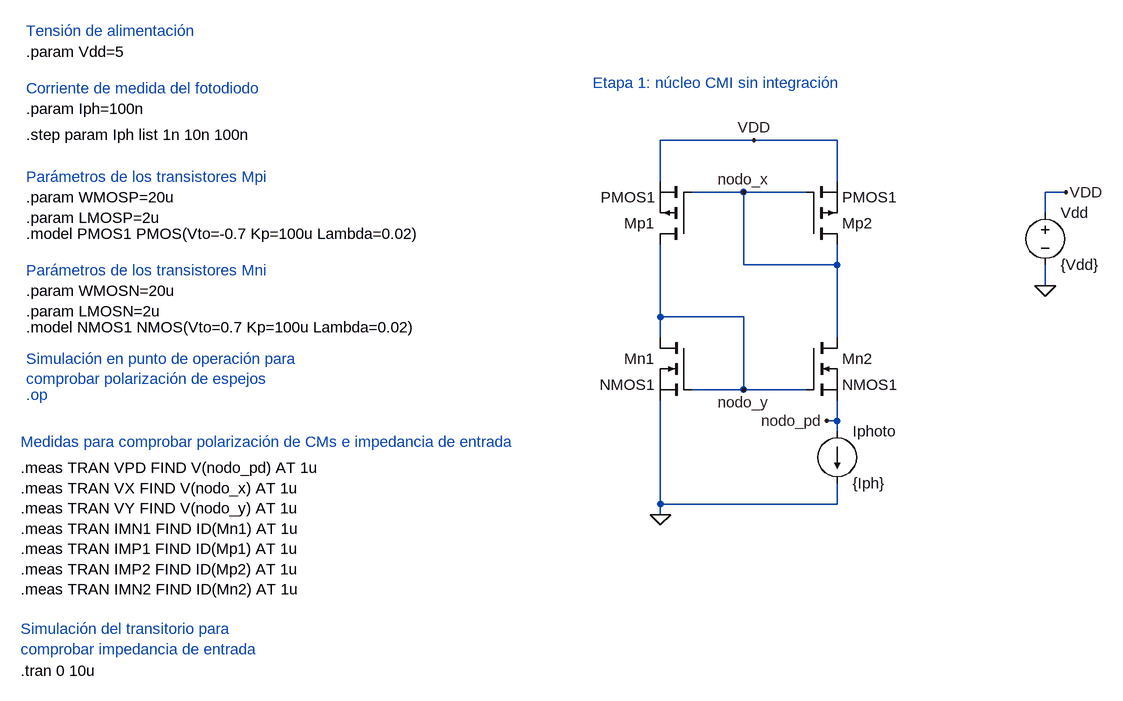
[diagram p0: schematic CMI_Etapa1.asc]
CMI_Etapa1.asc, the LTspice schematic file:
Version 4.1
SHEET 1 880 680
WIRE 144 -496 0 -496
WIRE 272 -496 144 -496
WIRE 0 -432 0 -496
WIRE 272 -432 272 -496
WIRE 128 -416 48 -416
WIRE 224 -416 128 -416
WIRE 624 -416 592 -416
WIRE 592 -384 592 -416
WIRE 128 -304 128 -416
WIRE 272 -304 272 -336
WIRE 272 -304 128 -304
WIRE 592 -272 592 -304
WIRE 0 -224 0 -336
WIRE 128 -224 0 -224
WIRE 0 -192 0 -224
WIRE 272 -192 272 -304
WIRE 128 -112 128 -224
WIRE 128 -112 48 -112
WIRE 224 -112 128 -112
WIRE 272 -64 272 -96
WIRE 272 -64 256 -64
WIRE 272 -48 272 -64
WIRE 0 64 0 -96
WIRE 272 64 272 32
WIRE 272 64 0 64
WIRE 0 80 0 64
FLAG 144 -496 VDD
FLAG 0 80 0
FLAG 256 -64 nodo_pd
FLAG 128 -416 nodo_x
FLAG 128 -112 nodo_y
FLAG 592 -272 0
FLAG 624 -416 VDD
SYMBOL current 272 -48 R0
SYMATTR InstName Iphoto
SYMATTR Value {Iph}
SYMBOL nmos 48 -192 M0
SYMATTR InstName Mn1
SYMATTR Value NMOS1
SYMATTR SpiceLine L={LMOSN} W={WMOSN}
SYMBOL nmos 224 -192 R0
SYMATTR InstName Mn2
SYMATTR Value NMOS1
SYMATTR SpiceLine L={LMOSN} W={WMOSN}
SYMBOL pmos 48 -336 R180
SYMATTR InstName Mp1
SYMATTR Value PMOS1
SYMATTR SpiceLine L={LMOSP} W={WMOSP}
SYMBOL pmos 224 -336 M180
SYMATTR InstName Mp2
SYMATTR Value PMOS1
SYMATTR SpiceLine L={LMOSP} W={WMOSP}
SYMBOL voltage 592 -400 R0
SYMATTR InstName Vdd
SYMATTR Value {Vdd}
TEXT -104 -584 Left 2 ;Etapa 1: núcleo CMI sin integración
TEXT -976 -576 Left 2 ;Corriente de medida del fotodiodo
TEXT -976 -544 Left 2 !.param Iph=100n
TEXT -976 -504 Left 2 !.step param Iph list 1n 10n 100n
TEXT -976 -408 Left 2 !.param WMOSP=20u\n.param LMOSP=2u
TEXT -976 -440 Left 2 ;Parámetros de los transistores Mpi
TEXT -976 -352 Left 2 !.model PMOS1 PMOS(Vto=-0.7 Kp=100u Lambda=0.02)
TEXT -976 -264 Left 2 !.param WMOSN=20u\n.param LMOSN=2u
TEXT -976 -296 Left 2 ;Parámetros de los transistores Mni
TEXT -976 -208 Left 2 !.model NMOS1 NMOS(Vto=0.7 Kp=100u Lambda=0.02)
TEXT -976 -664 Left 2 ;Tensión de alimentación
TEXT -976 -632 Left 2 !.param Vdd=5
TEXT -976 -104 Left 2 ;.op
TEXT -984 320 Left 2 !.tran 0 10u
TEXT -976 -160 Left 2 ;Simulación en punto de operación para \ncomprobar polarización de espejos
TEXT -984 256 Left 2 ;Simulación del transitorio para \ncomprobar impedancia de entrada
TEXT -984 8 Left 2 !.meas TRAN VPD FIND V(nodo_pd) AT 1u\n.meas TRAN VX FIND V(nodo_x) AT 1u\n.meas TRAN VY FIND V(nodo_y) AT 1u\n.meas TRAN IMN1 FIND ID(Mn1) AT 1u\n.meas TRAN IMP1 FIND ID(Mp1) AT 1u\n.meas TRAN IMP2 FIND ID(Mp2) AT 1u\n.meas TRAN IMN2 FIND ID(Mn2) AT 1u
TEXT -984 -32 Left 2 ;Medidas para comprobar polarización de CMs e impedancia de entrada

The netlist it stands for:
* CMI_Etapa1.asc
Iphoto nodo_pd 0 {Iph}
Mn1 nodo_y nodo_y 0 0 NMOS1 L={LMOSN} W={WMOSN}
Mn2 nodo_x nodo_y nodo_pd nodo_pd NMOS1 L={LMOSN} W={WMOSN}
Mp1 nodo_y nodo_x VDD VDD PMOS1 L={LMOSP} W={WMOSP}
Mp2 nodo_x nodo_x VDD VDD PMOS1 L={LMOSP} W={WMOSP}
Vdd VDD 0 {Vdd}
.model NMOS NMOS
.model PMOS PMOS
.lib standard.mos
* Etapa 1: núcleo CMI sin integración
* Corriente de medida del fotodiodo
.param Iph=100n
.step param Iph list 1n 10n 100n
.param WMOSP=20u
.param LMOSP=2u
* Parámetros de los transistores Mpi
.model PMOS1 PMOS(Vto=-0.7 Kp=100u Lambda=0.02)
.param WMOSN=20u
.param LMOSN=2u
* Parámetros de los transistores Mni
.model NMOS1 NMOS(Vto=0.7 Kp=100u Lambda=0.02)
* Tensión de alimentación
.param Vdd=5
* .op
.tran 0 10u
* Simulación en punto de operación para
* comprobar polarización de espejos
* Simulación del transitorio para
* comprobar impedancia de entrada
.meas TRAN VPD FIND V(nodo_pd) AT 1u
.meas TRAN VX FIND V(nodo_x) AT 1u
.meas TRAN VY FIND V(nodo_y) AT 1u
.meas TRAN IMN1 FIND ID(Mn1) AT 1u
.meas TRAN IMP1 FIND ID(Mp1) AT 1u
.meas TRAN IMP2 FIND ID(Mp2) AT 1u
.meas TRAN IMN2 FIND ID(Mn2) AT 1u
* Medidas para comprobar polarización de CMs e impedancia de entrada
.backanno
.end

* Results of the author's LTspice run, read from the files saved beside the schematic
* Operating Point (first step), zero values left out:
*   V(nodo_pd) = 106 µV
*   V(nodo_x) = 4.299 V
*   V(nodo_y) = 701.5 mV
*   V(vdd) = 5 V
*   I(Iphoto) = 1 nA
*   I(Vdd) = -2.078 nA
*   Ib(Mn2) = -4.308 pA
*   Ib(Mp1) = 4.309 pA
*   Id(Mn1) = 1.078 nA
*   Id(Mn2) = 1 nA
*   Id(Mp1) = -1.078 nA
*   Id(Mp2) = -1 nA
*   Is(Mn1) = -1.077 nA
*   Is(Mn2) = -995.7 pA
*   Is(Mp1) = 1.074 nA
*   Is(Mp2) = 999.3 pA
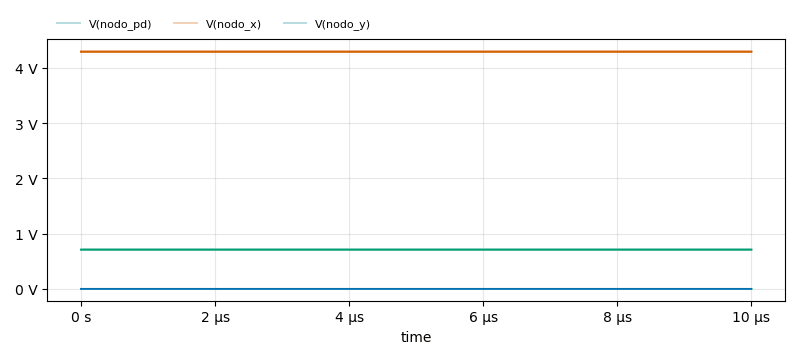
[diagram p1: Transient Analysis of CMI_Etapa1.asc, plotted from the saved traces]
* Transient Analysis, 3 runs:
*   V(nodo_pd) [iph=1e-09]: min 106 µV, max 106 µV, average 106 µV, rms 106 µV, last 106 µV
*   V(nodo_pd) [iph=1e-08]: min 307 µV, max 307 µV, average 307 µV, rms 307 µV, last 307 µV
*   V(nodo_pd) [iph=1e-07]: min 956.6 µV, max 956.6 µV, average 956.6 µV, rms 956.6 µV, last 956.6 µV
*   V(nodo_x) [iph=1e-09]: min 4.299 V, max 4.299 V, average 4.299 V, rms 4.299 V, last 4.299 V
*   V(nodo_x) [iph=1e-08]: min 4.296 V, max 4.296 V, average 4.296 V, rms 4.296 V, last 4.296 V
*   V(nodo_x) [iph=1e-07]: min 4.286 V, max 4.286 V, average 4.286 V, rms 4.286 V, last 4.286 V
*   V(nodo_y) [iph=1e-09]: min 701.5 mV, max 701.5 mV, average 701.5 mV, rms 701.5 mV, last 701.5 mV
*   V(nodo_y) [iph=1e-08]: min 704.6 mV, max 704.6 mV, average 704.6 mV, rms 704.6 mV, last 704.6 mV
*   V(nodo_y) [iph=1e-07]: min 714.5 mV, max 714.5 mV, average 714.5 mV, rms 714.5 mV, last 714.5 mV
* From the log:
*   Measurement: vpd
*     step  V(nodo_pd)   at
*        1  0.000105982740934  1e-06
*        2  0.000306984555209  1e-06
*        3  0.000956645002589  1e-06
*   Measurement: vx
*     step  V(nodo_x)   at
*        1  4.29859638214  1e-06
*        2  4.29555940628  1e-06
*        3  4.28595781326  1e-06
*   Measurement: vy
*     step  V(nodo_y)   at
*        1  0.701457202435  1e-06
*        2  0.704596757889  1e-06
*        3  0.714528560638  1e-06
*   Measurement: imn1
*     step  ID(Mn1)   at
*        1  1.07804154492e-09  1e-06
*        2  1.07152962059e-08  1e-06
*        3  1.07049331177e-07  1e-06
*   Measurement: imp1
*     step  ID(Mp1)   at
*        1  -1.07804154492e-09  1e-06
*        2  -1.07152962059e-08  1e-06
*        3  -1.07049331177e-07  1e-06
*   Measurement: imp2
*     step  ID(Mp2)   at
*        1  -9.99999971718e-10  1e-06
*        2  -9.99999993923e-09  1e-06
*        3  -1.00000001169e-07  1e-06
*   Measurement: imn2
*     step  ID(Mn2)   at
*        1  9.99999971718e-10  1e-06
*        2  9.99999993923e-09  1e-06
*        3  1.00000001169e-07  1e-06